# EAGLE design tempSens_Photon (EAGLE 7.4.0)
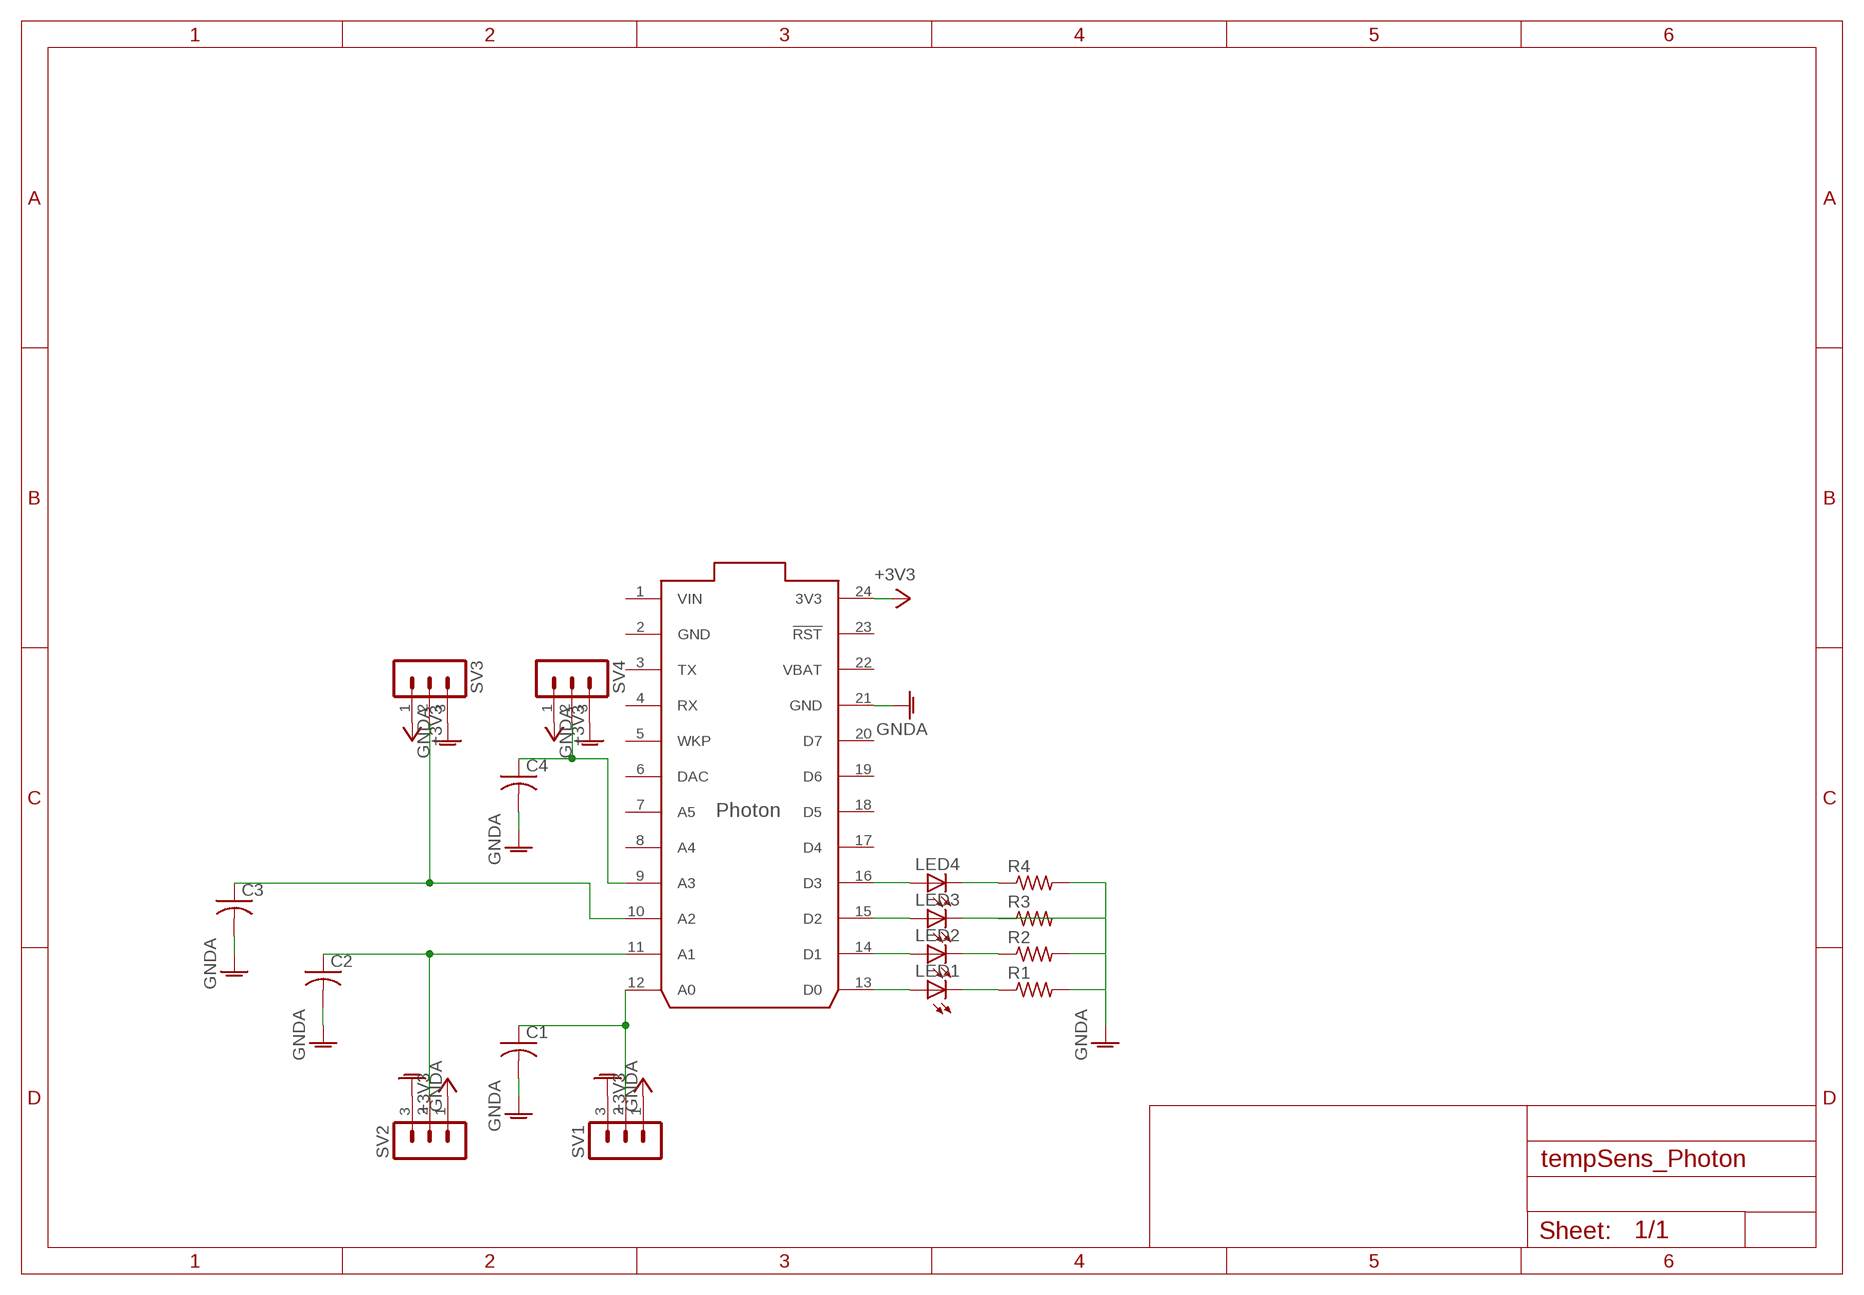
[diagram p0: schematic, sheet 1]

## Parts
C1  C-USC0805  [C0805]
C2  C-USC0805  [C0805]
C3  C-USC0805  [C0805]
C4  C-USC0805  [C0805]
LED1  LEDCHIPLED_0805  [CHIPLED_0805]
LED2  LEDCHIPLED_0805  [CHIPLED_0805]
LED3  LEDCHIPLED_0805  [CHIPLED_0805]
LED4  LEDCHIPLED_0805  [CHIPLED_0805]
R1  R-US_R0805  [R0805]
R2  R-US_R0805  [R0805]
R3  R-US_R0805  [R0805]
R4  R-US_R0805  [R0805]
SV1  CONN3PIN  [MA03-1]
SV2  CONN3PIN  [MA03-1]
SV3  CONN3PIN  [MA03-1]
SV4  CONN3PIN  [MA03-1]
U$1  PHOTON_SMD  [PHOTON_SMD]

## Nets
+3V3: SV1.1 SV2.1 SV3.1 SV4.1 U$1.24(3V3)
GND: C1.2 C2.2 C3.2 C4.2 R1.2 R2.2 R3.1 R4.2 SV1.3 SV2.3 SV3.3 SV4.3 U$1.21(GND) ; supply symbol labelled GNDA
N$1: C1.1 SV1.2 U$1.12(A0)
N$2: C2.1 SV2.2 U$1.11(A1)
N$3: C3.1 SV3.2 U$1.10(A2)
N$4: C4.1 SV4.2 U$1.9(A3)
N$5: LED1.A U$1.13(D0)
N$6: LED2.A U$1.14(D1)
N$7: LED3.A U$1.15(D2)
N$8: LED4.A U$1.16(D3)
N$9: LED1.C R1.1
N$10: LED2.C R2.1
N$11: LED3.C R3.2
N$12: LED4.C R4.1
Unconnected: U$1.3(TX) U$1.4(RX) U$1.5(WKP) U$1.6(DAC) U$1.7(A5) U$1.8(A4) U$1.17(D4) U$1.18(D5) U$1.19(D6) U$1.20(D7) U$1.23(!RST) U$1.25(EN) U$1.26(!SETUP) U$1.27(RGB_RED) U$1.28(RGB_GREEN) U$1.29(RGB_BLUE) U$1.30(USB_D-) U$1.31(USB_D+)

## Power pins joined to a net without a drawn wire
GND: U$1.2(GND)
VBAT: U$1.22(VBAT)
VIN: U$1.1(VIN)

## Library data of the parts
C1-C4 = rcl:C-US: CAPACITOR, American symbol
LED1-LED4 = led:LED: LED OSRAM: - CHIPLED LG R971, LG N971, LY N971, LG Q971, LY Q971, LO R971, LY R971 LH N974, LH R974 LS Q976, LO Q976, LY Q976 LO Q996 - Hyper CHIPLED LW Q18S LB Q993, LB Q99A, LB R99A - SideLED LS A670, LO A670, LY A670, LG A670, LP A670 LB A673, LV A673, LT A673, LW A673 LH A674 LY A675 LS A676, LA A676, LO A676, LY A676, LW A676 LS A679, LY A679, LG A679 - Hyper Micro SIDELED® LS Y876, LA Y876, LO Y876, LY Y876 LT Y87S - SmartLED LW L88C, LW L88S LB L89C, LB L89S, LG L890 LS L89K, LO L89K, LY L89K LS L896, LA L896, LO L896, LY L896 - TOPLED LS T670, LO T670, LY T670, LG T670, LP T670 LSG T670, LSP T670, LSY T670, LOP T670, LYG T670 LG T671, LOG T671, LSG T671 LB T673, LV T673, LT T673, LW T673 LH T674 LS T676, LA T676, LO T676, LY T676, LB T676, LH T676, LSB T676, LW T676 LB T67C, LV T67C, LT T67C, LS T67K, LO T67K, LY T67K, LW E67C LS E67B, LA E67B, LO E67B, LY E67B, LB E67C, LV E67C, LT E67C LW T67C LS T679, LY T679, LG T679 LS T770, LO T770, LY T770, LG T770, LP T770 LB T773, LV T773, LT T773, LW T773 LH T774 LS E675, LA E675, LY E675, LS T675 LS T776, LA T776, LO T776, LY T776, LB T776 LHGB T686 LT T68C, LB T68C - Hyper Mini TOPLED® LB M676 - Mini TOPLED Santana® LG M470 LS M47K, LO M47K, LY M47K Source: http://www.osram.convergy.de LUXEON: - LUMILED® LXK2-PW12-R00, LXK2-PW12-S00, LXK2-PW14-U00, LXK2-PW14-V00 LXK2-PM12-R00, LXK2-PM12-S00, LXK2-PM14-U00 LXK2-PE12-Q00, LXK2-PE12-R00, LXK2-PE12-S00, LXK2-PE14-T00, LXK2-PE14-U00 LXK2-PB12-K00, LXK2-PB12-L00, LXK2-PB12-M00, LXK2-PB14-N00, LXK2-PB14-P00, LXK2-PB14-Q00 LXK2-PR12-L00, LXK2-PR12-M00, LXK2-PR14-Q00, LXK2-PR14-R00 LXK2-PD12-Q00, LXK2-PD12-R00, LXK2-PD12-S00 LXK2-PH12-R00, LXK2-PH12-S00 LXK2-PL12-P00, LXK2-PL12-Q00, LXK2-PL12-R00 Source: www.luxeon.com KINGBRIGHT: KA-3528ASYC Source: www.kingbright.com
R1-R4 = rcl:R-US_: RESISTOR, American symbol
SV1-SV4 = Lutz_lab:CONN3PIN: PIN HEADER; OC_FARNELL: unknown; OC_NEWARK: unknown
U$1 = Lutz_lab:PHOTON_SMD: Photon (without headers) - designed to be surface mounted with 7 extra exposed pads on the bottom of the board which include, 3 RGB LED outputs, /SETUP, EN (3.3V SMPS enable input), USB D+ and USB D-.

## Board
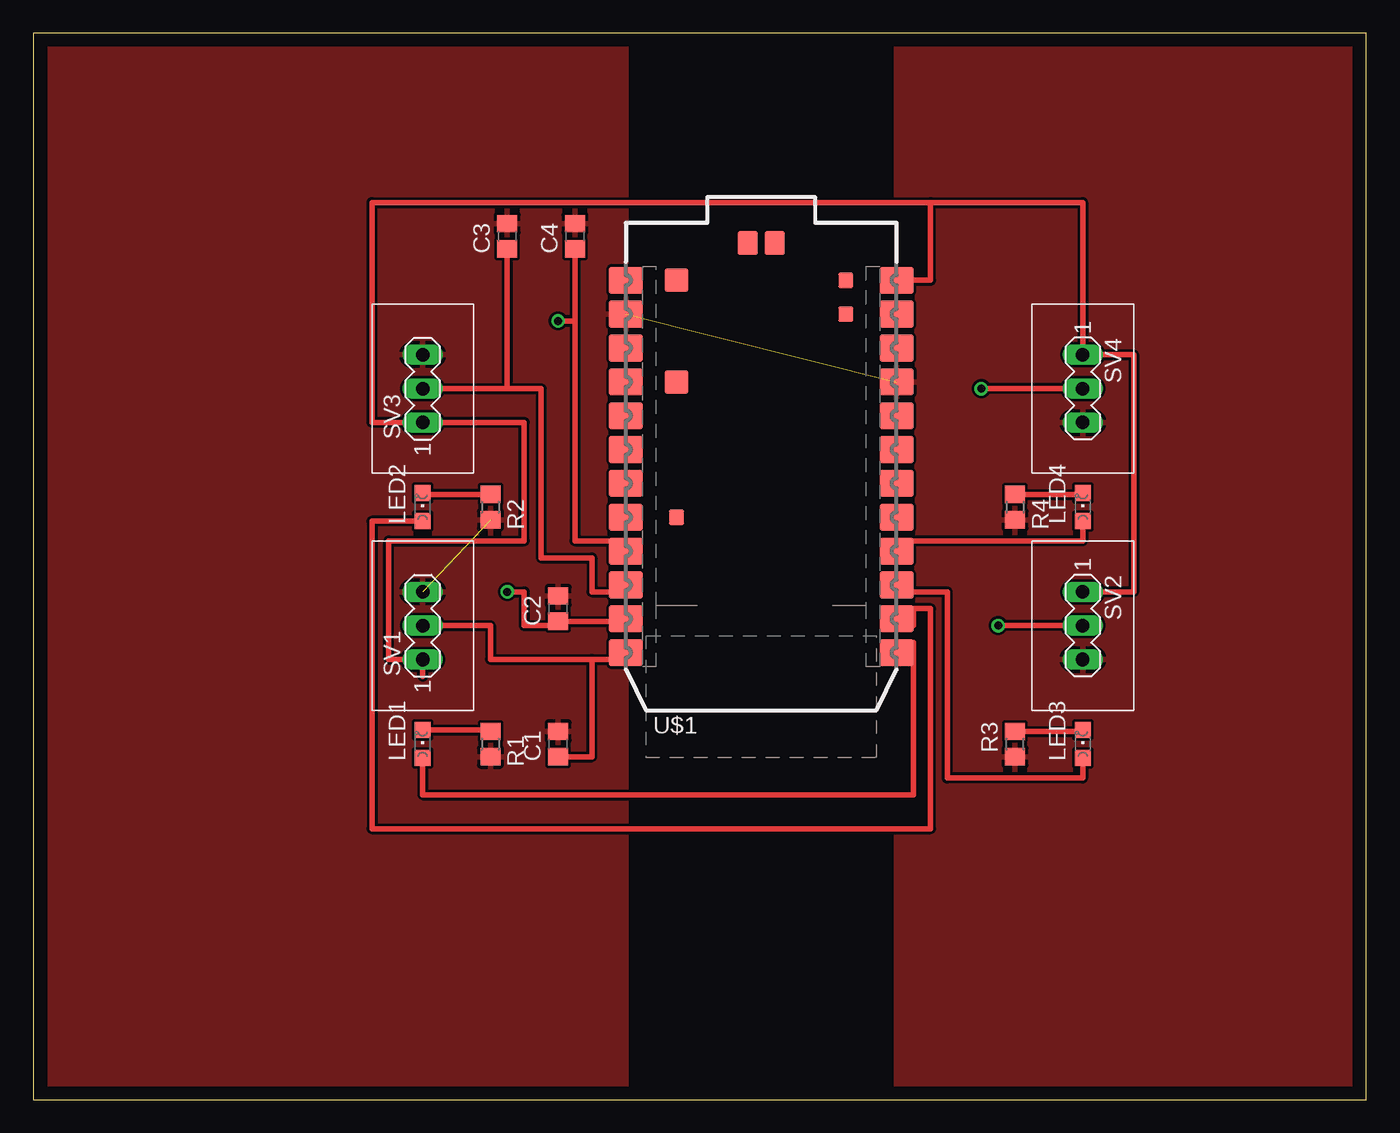
[diagram p1: board, top side]
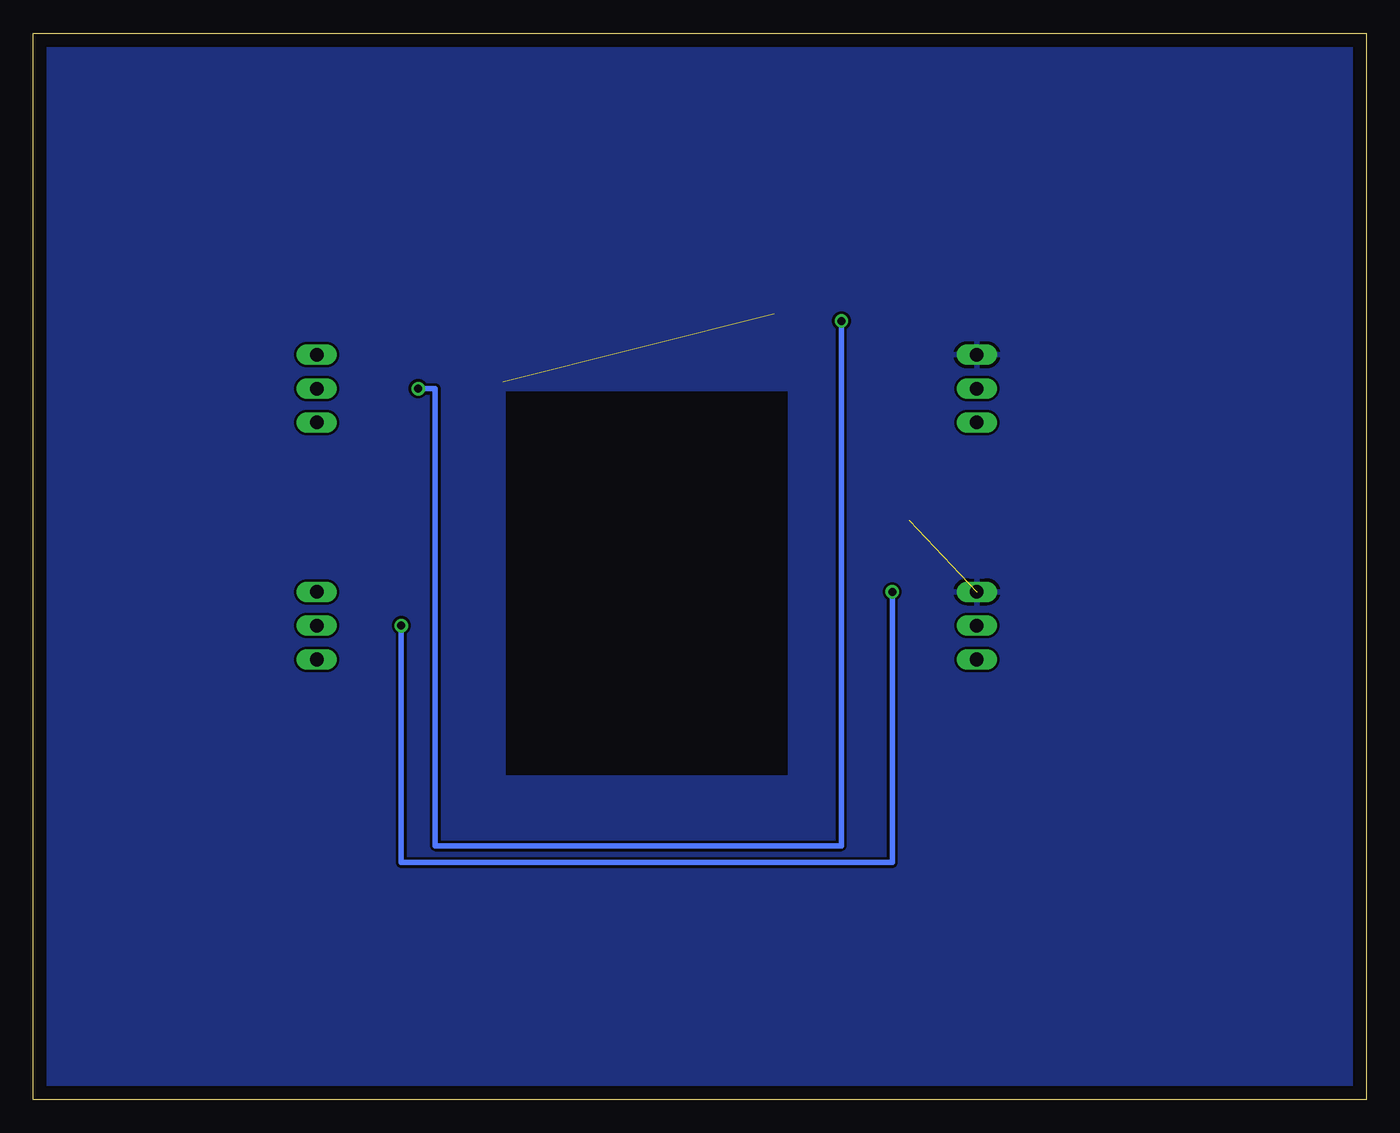
[diagram p2: board, bottom side, seen from below]

Size 100 x 80 mm. Coordinates in mm from the lower left corner, seen from the top.
Outline: 0,0 100,0 100,80 0,80 0,0
Copper layers (1*16): Top 0.035mm / dielectric 1.5mm / Bottom 0.035mm
Design rules "default": minimum track width 10mil, minimum drill 24mil, track to track 8mil, track to pad 8mil, pad to pad 8mil, via to via 8mil, smd to smd 8mil, copper to edge 40mil, drill to drill 8mil, minimum pad ring 10mil, minimum via ring 8mil, stop-mask expansion 4mil, vias tented up to drill 0mil, thermal gap 10mil

### Footprints (pad centres in the part's own frame; a part is rotated, then mirrored left to right if it is on the bottom)
C0805 = smd 1.3 x 1.5: 1 -0.95,0; 2 0.95,0
CHIPLED_0805 = smd 1.2 x 1.2: A 0,-1.05; C 0,1.05
R0805 = smd 1.3 x 1.5: 1 -0.95,0; 2 0.95,0
MA03-1 = drill 1.016 long: 1 -2.54,0; 2 0,0; 3 2.54,0
PHOTON_SMD = smd 2.54 x 2.032: 1 0,32.258; 2 0,29.718; 3 0,27.178; 4 0,24.638; 5 0,22.098; 6 0,19.558; 7 0,17.018; 8 0,14.478; 9 0,11.938; 10 0,9.398; 11 0,6.858; 12 0,4.318; 13 20.32,4.318; 14 20.32,6.858; 15 20.32,9.398; 16 20.32,11.938; 17 20.32,14.478; 18 20.32,17.018; 19 20.32,19.558; 20 20.32,22.098; 21 20.32,24.638; 22 20.32,27.178; 23 20.32,29.718; 24 20.32,32.258 | smd 1.778 x 1.778: 25 3.81,32.258; 26 3.81,24.638 | smd 1.143 x 1.143: 27 3.81,14.478; 28 16.51,29.718; 29 16.51,32.258 | smd 1.524 x 1.778: 30 11.176,35.052; 31 9.144,35.052

### Placement (x,y rotation side)
C1  39.37,26.67 90 top
C2  39.37,36.83 90 top
C3  35.56,64.77 90 top
C4  40.64,64.77 90 top
LED1  29.21,26.67 0 top
LED2  29.21,44.45 0 top
LED3  78.74,26.67 0 top
LED4  78.74,44.45 0 top
R1  34.29,26.67 270 top
R2  34.29,44.45 270 top
R3  73.66,26.67 90 top
R4  73.66,44.45 270 top
SV1  29.21,35.56 90 top
SV2  78.74,35.56 270 top
SV3  29.21,53.34 90 top
SV4  78.74,53.34 270 top
U$1  44.45,29.21 0 top

### Tracks (layer width: path | path; a pad name or v marks a point on that pad's centre or on a via)
+3V3
  Top 0.406: 29.21,31.75 SV1.1 26.67,33.02 26.67,41.91 36.83,41.91 36.83,50.8 SV3.1 25.4,50.8 25.4,67.31 67.31,67.31 | 67.31,67.31 78.74,67.31 SV4.1 82.55,55.88 82.55,38.1 SV2.1 | U$1.24 67.31,61.47 67.31,67.31
GND  (2 unrouted)
  pour Bottom: 0,80.01 0,0 43.18,0 43.18,80.01
  pour Bottom: 38.1,80.01 38.1,53.34 69.85,53.34 69.85,54.61 69.85,80.01
  pour Bottom: 39.37,24.13 67.31,24.13 67.31,0 39.37,0
  pour Top: 1.27,80.01 44.45,80.01 44.45,0 1.27,0
  pour Top: 64.77,80.01 64.77,0 99.06,0 99.06,78.74 99.06,80.01
N$1
  Top 0.406: U$1.12 44.45,33.02 41.91,33.02 | C1.1 41.91,25.72 41.91,33.02 | SV1.2 34.29,35.56 34.29,33.02 41.91,33.02
N$2  (via drill 0.6)
  Top 0.406: U$1.11 44.45,35.88 C2.1 39.37,35.56 36.83,35.56 36.83,38.1 v35.56,38.1 | SV2.2 v72.39,35.56
  Bottom 0.406: v72.39,35.56 72.39,17.78 35.56,17.78 v35.56,38.1
N$3
  Top 0.406: U$1.10 44.45,38.1 41.91,38.1 41.91,40.64 38.1,40.64 38.1,53.34 35.56,53.34 | SV3.2 35.56,53.34 | C3.1 35.56,53.34
N$4  (via drill 0.6)
  Top 0.406: U$1.9 44.45,41.91 40.64,41.91 40.64,58.42 | C4.1 40.64,58.42 | SV4.2 v71.12,53.34 | v39.37,58.42 40.64,58.42
  Bottom 0.406: v71.12,53.34 69.85,53.34 69.85,19.05 39.37,19.05 v39.37,58.42
N$5
  Top 0.406: 64.77,33.02 U$1.13 64.77,34.29 66.04,34.29 66.04,22.86 29.21,22.86 LED1.A
N$6
  Top 0.406: LED2.A 25.4,43.4 25.4,20.32 67.31,20.32 67.31,36.83 66.04,36.83 66.04,35.56 64.77,35.56 U$1.14
N$7
  Top 0.406: LED3.A 78.74,24.13 68.58,24.13 68.58,38.1 64.77,38.1 U$1.15
N$8
  Top 0.406: 64.77,40.64 U$1.16 64.77,41.91 78.74,41.91 LED4.A
N$9
  Top 0.406: LED1.C 34.29,27.72 R1.1
N$10
  Top 0.406: R2.1 29.21,45.4 LED2.C
N$11
  Top 0.406: R3.2 78.74,27.62 LED3.C
N$12
  Top 0.406: R4.1 78.74,45.4 LED4.C
N$14
  pour Bottom: 64.77,80.01 64.77,0 100.33,0 100.33,80.01